# EAGLE design doodle with clock3 jump3 (EAGLE 6.2)
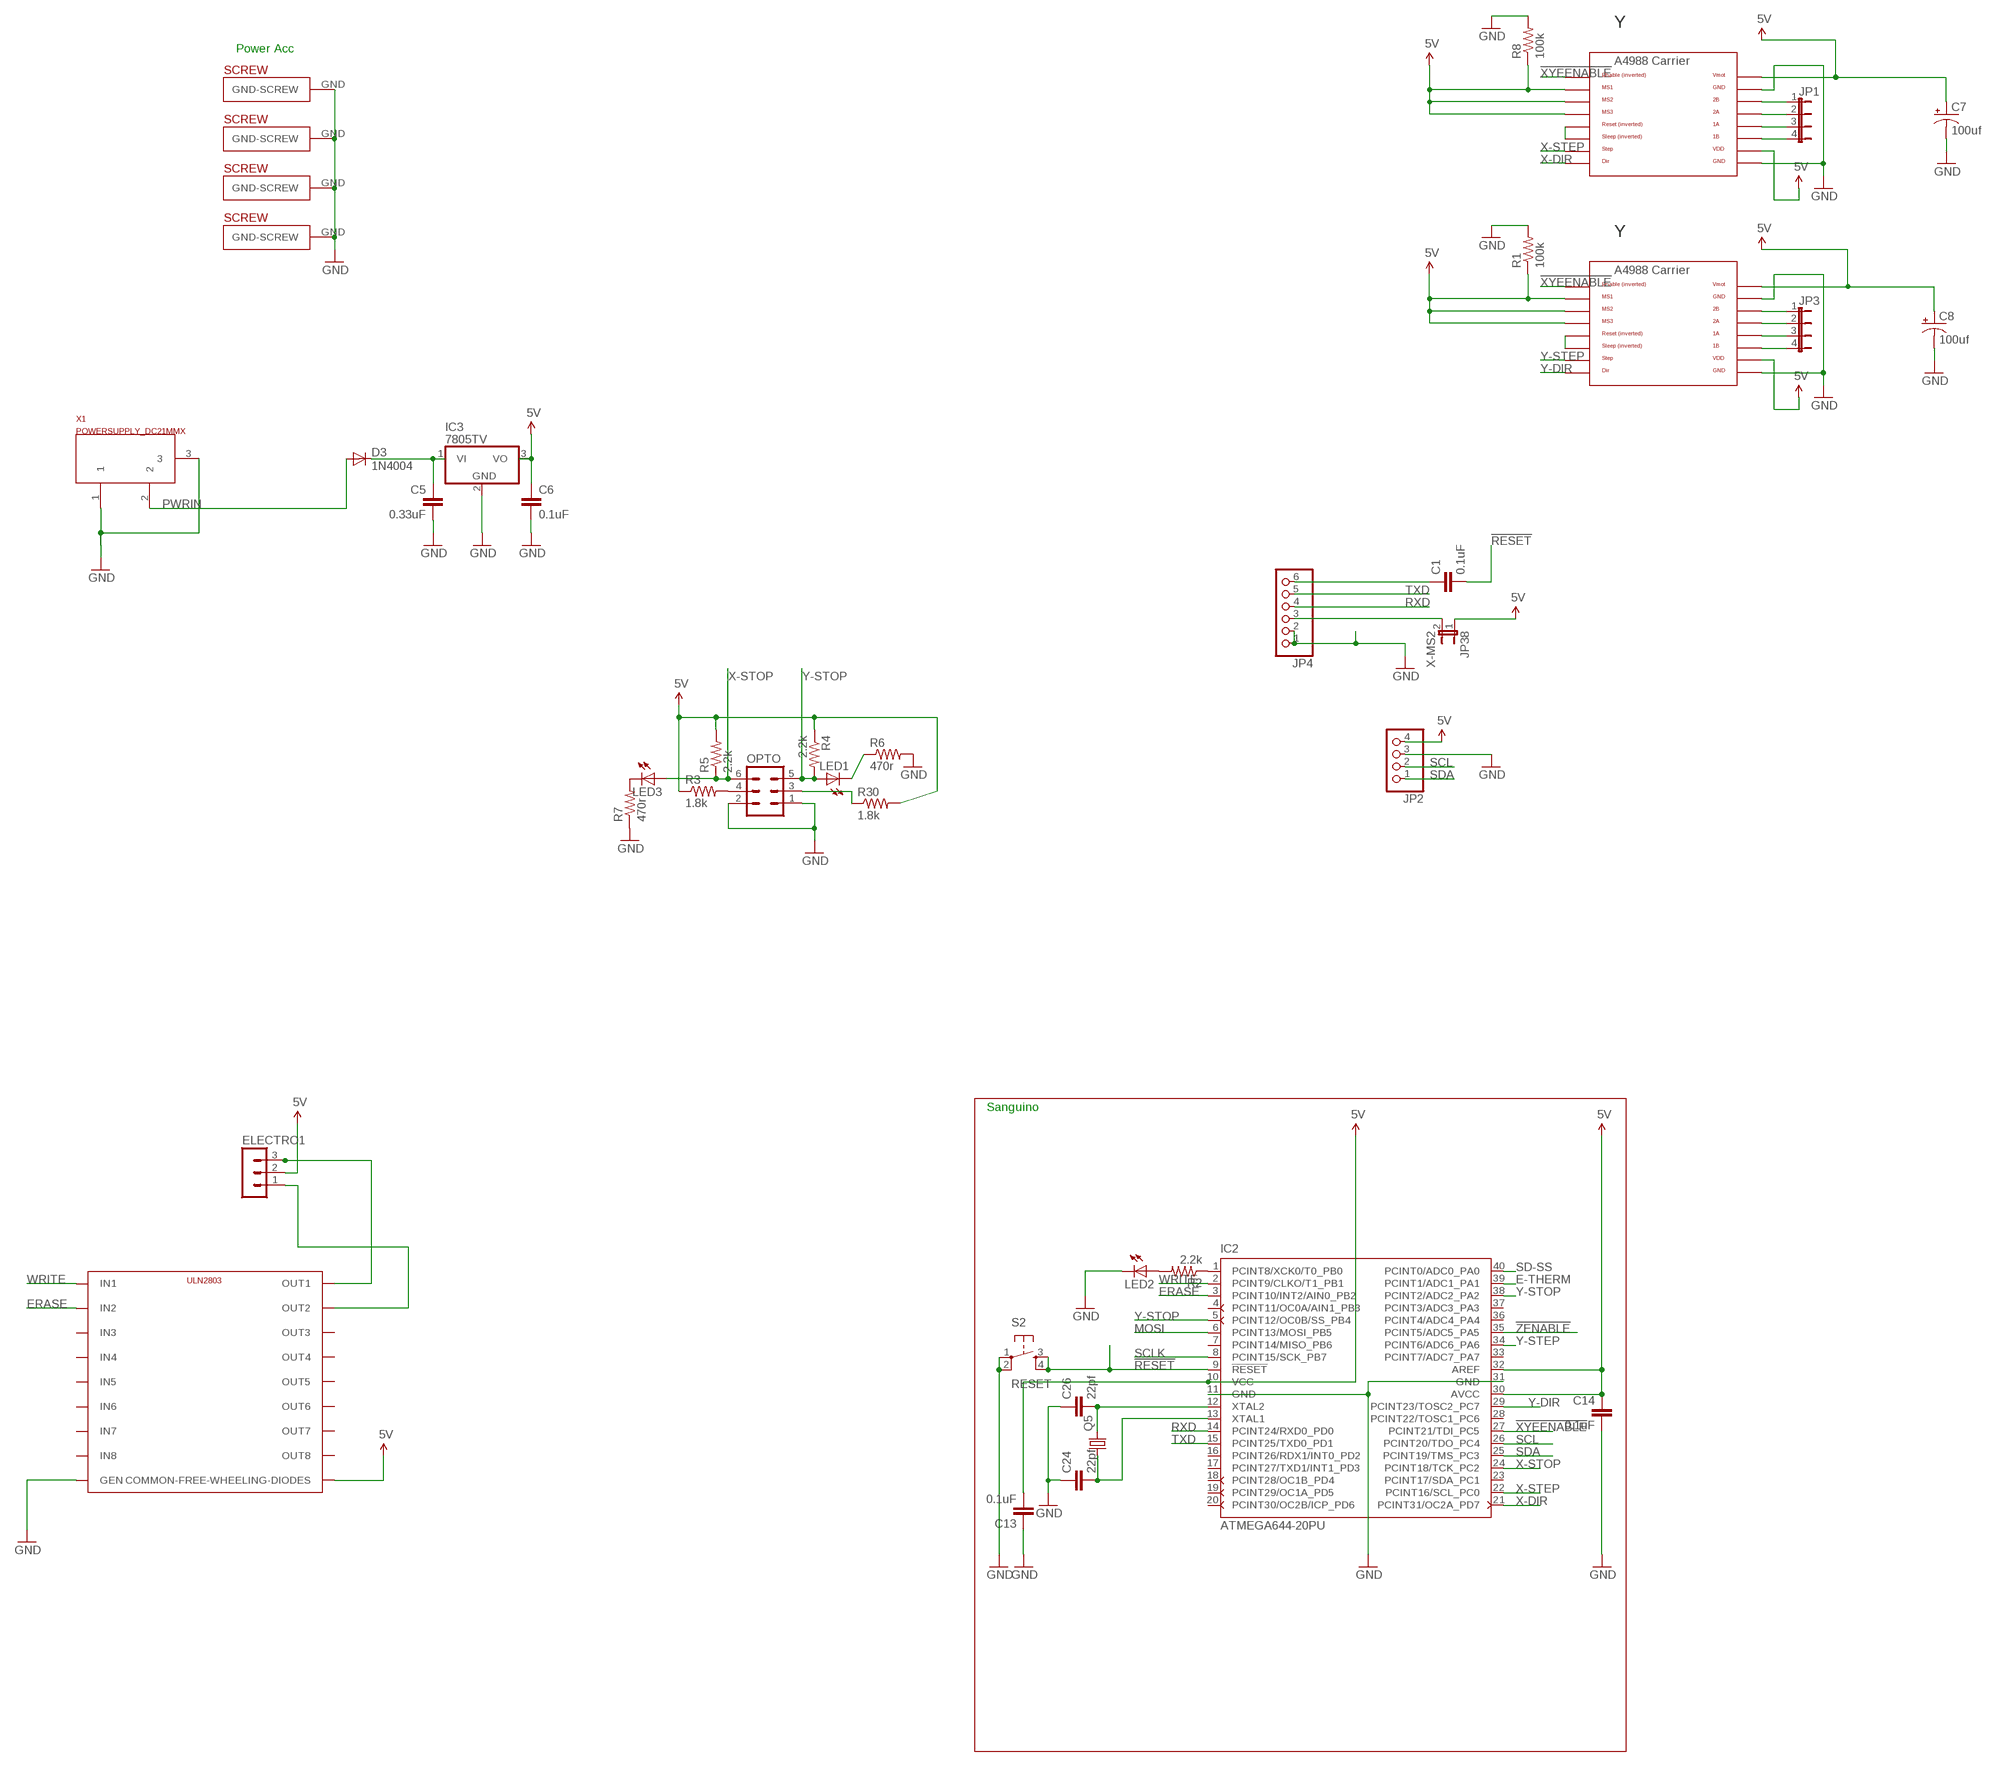
[diagram p0: schematic, sheet 1]

## Parts
C1  0.1uF  CAPPTH2  [CAP-PTH-SMALL2]
C5  0.33uF  CAPPTH2  [CAP-PTH-SMALL2]
C6  0.1uF  CAPPTH2  [CAP-PTH-SMALL2]
C7  100uf  CAP_POLPTH1  [CPOL-RADIAL-100UF-25V]
C8  100uf  CAP_POLPTH1  [CPOL-RADIAL-100UF-25V]
C13  0.1uF  CAPPTH2  [CAP-PTH-SMALL2]
C14  0.1uF  CAPPTH2  [CAP-PTH-SMALL2]
C24  22pf  CAPPTH2  [CAP-PTH-SMALL2]
C26  22pf  CAPPTH2  [CAP-PTH-SMALL2]
D3  1N4004  [DO41-10]
ELECTRO1  MA03-1  [MA03-1]
IC2  ATMEGA644-20PU  [DIL40]
IC3  7805TV  [TO220V]
JP1  JP4E  [JP4]
JP2  PINHD-1X4  [1X04]
JP3  JP4E  [JP4]
JP4  PINHD-1X6/90  [1X06/90]
JP38  X-MS2  JUMPER-2PTH  [1X02]
LED1  LED3MM  [LED3MM]
LED2  LED3MM  [LED3MM]
LED3  LED3MM  [LED3MM]
OPTO  MA03-2  [MA03-2]
Q5  CRYSTALHC49S  [HC49/S]
R1  100k  R-US_0207/7  [0207/7]
R2  2.2k  R-US_0207/2V  [0207/2V]
R3  1.8k  R-US_0207/2V  [0207/2V]
R4  2.2k  R-US_0207/2V  [0207/2V]
R5  2.2k  R-US_0207/2V  [0207/2V]
R6  470r  R-US_0207/2V  [0207/2V]
R7  470r  R-US_0207/2V  [0207/2V]
R8  100k  R-US_0207/7  [0207/7]
R30  1.8k  R-US_0207/2V  [0207/2V]
S2  RESET  TAC_SWITCHPTH  [TACTILE-PTH]
U$1  A4988BREAKOUT  [A4988BREAKOUT]
U$2  ULN2803  [P-DIP]
U$7  A4988BREAKOUT  [A4988BREAKOUT]
U$14  PLATED-SCREW  [PLATEDSCREW]
U$17  PLATED-SCREW  [PLATEDSCREW]
U$18  PLATED-SCREW  [PLATEDSCREW]
U$38  PLATED-SCREW  [PLATEDSCREW]
X1  POWERSUPPLY_DC21MMX  [POWERSUPPLY_DC-21MM]

## Nets
5V: C6.1 C7.1(+) C8.1(+) C13.2 C14.1 ELECTRO1.2 IC2.10(VCC) IC2.30(AVCC) IC2.32(AREF) IC3.3(VO) JP2.4 JP38.1 R1.1 R3.1 R4.1 R5.2 R8.1 R30.2 U$1.MS1 U$1.MS2 U$1.MS3 U$1.VDD U$1.VMOT U$2.COMMON-FREE-WHEELING-DIODES U$7.MS1 U$7.MS2 U$7.MS3 U$7.VDD U$7.VMOT
!RESET: C1.2 IC2.9(!RESET) S2.3 S2.4
!XYEENABLE: IC2.27(PCINT21/TDI_PC5) U$1.EN U$7.EN
!ZENABLE: IC2.35(PCINT5/ADC5_PA5)
E-THERM: IC2.39(PCINT1/ADC1_PA1)
ERASE: IC2.3(PCINT10/INT2/AIN0_PB2) U$2.IN2
GND: C5.2 C6.2 C7.2(-) C8.2(-) C13.1 C14.2 C24.1 C26.1 IC2.11(GND) IC2.31(GND) IC3.2(GND) JP2.3 JP4.1 JP4.2 LED2.K(C) OPTO.1 OPTO.2 R1.2 R6.2 R7.1 R8.2 S2.1 S2.2 U$1.GND U$1.GND@0(GND) U$2.GEN U$7.GND U$7.GND@0(GND) U$14.GND(GND-SCREW) U$17.GND(GND-SCREW) U$18.GND(GND-SCREW) U$38.GND(GND-SCREW) X1.1 X1.3
MOSI: IC2.6(PCINT13/MOSI_PB5)
N$1: U$1.RST U$1.SLP(SLEEP)
N$2: JP3.1 U$1.2B
N$3: JP3.2 U$1.2A
N$4: JP3.3 U$1.1A
N$5: JP3.4 U$1.1B
N$6: IC2.1(PCINT8/XCK0/T0_PB0) R2.1
N$7: LED2.A R2.2
N$9: OPTO.4 R3.2
N$11: LED1.K(C) R6.1
N$12: LED3.K(C) R7.2
N$13: OPTO.3 R30.1
N$14: JP1.1 U$7.2B
N$15: JP1.2 U$7.2A
N$16: JP1.3 U$7.1A
N$17: JP1.4 U$7.1B
N$18: ELECTRO1.1 U$2.OUT2
N$19: ELECTRO1.3 U$2.OUT1
N$23: U$7.RST U$7.SLP(SLEEP)
N$68: C5.1 D3.C IC3.1(VI)
N$70: C1.1 JP4.6
N$71: JP4.3 JP38.2
N$80: C26.2 IC2.12(XTAL2) Q5.2
N$81: C24.2 IC2.13(XTAL1) Q5.1
PWRIN [Power]: D3.A X1.2
RXD: IC2.14(PCINT24/RXD0_PD0) JP4.4
SCL: IC2.26(PCINT20/TDO_PC4) JP2.2
SCLK: IC2.8(PCINT15/SCK_PB7)
SD-SS: IC2.40(PCINT0/ADC0_PA0)
SDA: IC2.25(PCINT19/TMS_PC3) JP2.1
TXD: IC2.15(PCINT25/TXD0_PD1) JP4.5
WRITE: IC2.2(PCINT9/CLKO/T1_PB1) U$2.IN1
X-DIR: IC2.21(PCINT31/OC2A_PD7) U$7.DIR
X-STEP: IC2.22(PCINT16/SCL_PC0) U$7.STEP
X-STOP: IC2.24(PCINT18/TCK_PC2) LED3.A OPTO.6 R5.1
Y-DIR: IC2.29(PCINT23/TOSC2_PC7) U$1.DIR
Y-STEP: IC2.34(PCINT6/ADC6_PA6) U$1.STEP
Y-STOP: IC2.5(PCINT12/OC0B/SS_PB4) IC2.38(PCINT2/ADC2_PA2) LED1.A OPTO.5 R4.2
Unconnected: IC2.4(PCINT11/OC0A/AIN1_PB3) IC2.7(PCINT14/MISO_PB6) IC2.16(PCINT26/RDX1/INT0_PD2) IC2.17(PCINT27/TXD1/INT1_PD3) IC2.18(PCINT28/OC1B_PD4) IC2.19(PCINT29/OC1A_PD5) IC2.20(PCINT30/OC2B/ICP_PD6) IC2.23(PCINT17/SDA_PC1) IC2.28(PCINT22/TOSC1_PC6) IC2.33(PCINT7/ADC7_PA7) IC2.36(PCINT4/ADC4_PA4) IC2.37(PCINT3/ADC3_PA3) U$2.IN3 U$2.IN4 U$2.IN5 U$2.IN6 U$2.IN7 U$2.IN8 U$2.OUT3 U$2.OUT4 U$2.OUT5 U$2.OUT6 U$2.OUT7 U$2.OUT8

## Notes on the sheet
- Y
- Power Acc
- Y
- Sanguino

## Library data of the parts
C1 C5 C6 C13 C14 C24 C26 = SparkFun:CAP: Capacitor Standard 0603 ceramic capacitor, and 0.1" leaded capacitor.
C7 C8 = SparkFun:CAP_POL: Capacitor Polarized These are standard SMD and PTH capacitors. Normally 10uF, 47uF, and 100uF in electrolytic and tantalum varieties. Always verify the external diameter of the through hole cap, it varies with capacity, voltage, and manufacturer. The EIA devices should be standard.
D3 = diode:1N4004: DIODE general purpose rectifier, 1 A
ELECTRO1 = con-lstb:MA03-1: PIN HEADER; OC_FARNELL: unknown; OC_NEWARK: unknown
IC2 = atmel:ATMEGA644-*PU: 8-bit Microcontroller with 64K Bytes In-System Programmable Flash Auto generated by make-symbol-device-package-bsdl.ulp Rev. 34 Source: http://www.atmel.com/dyn/resources/prod_documents/doc2593.pdf; MPN: ATMEGA644-20PU; OC_FARNELL: 1288340; OC_NEWARK: 23M5060
IC3 = linear:78*: Positive VOLTAGE REGULATOR Source: http://cache.national.com/ds/LM/LM78L05.pdf http://www.fairchildsemi.com/ds/LM/LM7805.pdf
JP1 JP3 = jumper:JP4E: JUMPER
JP2 = pinhead:PINHD-1X4: PIN HEADER
JP4 = pinhead:PINHD-1X6: PIN HEADER
JP38 = SparkFun:JUMPER-2: Jumper Basic 0.1" spaced jumper. Use with breakaway headers.
LED1-LED3 = led:LED: LED OSRAM: - CHIPLED LG R971, LG N971, LY N971, LG Q971, LY Q971, LO R971, LY R971 LH N974, LH R974 LS Q976, LO Q976, LY Q976 LO Q996 - Hyper CHIPLED LW Q18S LB Q993, LB Q99A, LB R99A - SideLED LS A670, LO A670, LY A670, LG A670, LP A670 LB A673, LV A673, LT A673, LW A673 LH A674 LY A675 LS A676, LA A676, LO A676, LY A676, LW A676 LS A679, LY A679, LG A679 - Hyper Micro SIDELED® LS Y876, LA Y876, LO Y876, LY Y876 LT Y87S - SmartLED LW L88C, LW L88S LB L89C, LB L89S, LG L890 LS L89K, LO L89K, LY L89K LS L896, LA L896, LO L896, LY L896 - TOPLED LS T670, LO T670, LY T670, LG T670, LP T670 LSG T670, LSP T670, LSY T670, LOP T670, LYG T670 LG T671, LOG T671, LSG T671 LB T673, LV T673, LT T673, LW T673 LH T674 LS T676, LA T676, LO T676, LY T676, LB T676, LH T676, LSB T676, LW T676 LB T67C, LV T67C, LT T67C, LS T67K, LO T67K, LY T67K, LW E67C LS E67B, LA E67B, LO E67B, LY E67B, LB E67C, LV E67C, LT E67C LW T67C LS T679, LY T679, LG T679 LS T770, LO T770, LY T770, LG T770, LP T770 LB T773, LV T773, LT T773, LW T773 LH T774 LS E675, LA E675, LY E675, LS T675 LS T776, LA T776, LO T776, LY T776, LB T776 LHGB T686 LT T68C, LB T68C - Hyper Mini TOPLED® LB M676 - Mini TOPLED Santana® LG M470 LS M47K, LO M47K, LY M47K Source: http://www.osram.convergy.de LUXEON: - LUMILED® LXK2-PW12-R00, LXK2-PW12-S00, LXK2-PW14-U00, LXK2-PW14-V00 LXK2-PM12-R00, LXK2-PM12-S00, LXK2-PM14-U00 LXK2-PE12-Q00, LXK2-PE12-R00, LXK2-PE12-S00, LXK2-PE14-T00, LXK2-PE14-U00 LXK2-PB12-K00, LXK2-PB12-L00, LXK2-PB12-M00, LXK2-PB14-N00, LXK2-PB14-P00, LXK2-PB14-Q00 LXK2-PR12-L00, LXK2-PR12-M00, LXK2-PR14-Q00, LXK2-PR14-R00 LXK2-PD12-Q00, LXK2-PD12-R00, LXK2-PD12-S00 LXK2-PH12-R00, LXK2-PH12-S00 LXK2-PL12-P00, LXK2-PL12-Q00, LXK2-PL12-R00 Source: www.luxeon.com KINGBRIGHT: KA-3528ASYC Source: www.kingbright.com
OPTO = con-lstb:MA03-2: PIN HEADER; OC_FARNELL: unknown; OC_NEWARK: unknown
Q5 = crystal:CRYSTAL: CRYSTAL; OC_FARNELL: 1667008; OC_NEWARK: unknown
R1 R8 = adafruit:R-US_: RESISTOR, American symbol
R2-R7 R30 = resistor:R-US_: RESISTOR, American symbol
S2 = SparkFun:TAC_SWITCH: Momentary Switch Button commonly used for reset or general input. Spark Fun Electronics SKU : COM-00097
U$1 U$7 = RepRapjr:A4988BREAKOUT
U$2 = ULN2803:ULN2803
U$14 U$17 U$18 U$38 = Sanguinololu:PLATED-SCREW
X1 = SmartPrj:POWERSUPPLY_DC21MM

## Net classes
1 Power: width 0.3 mm, drill 0.406 mm, clearance 0.178 mm
2 gnd: width 0.305 mm, drill 0.559 mm, clearance 0.254 mm

## Board
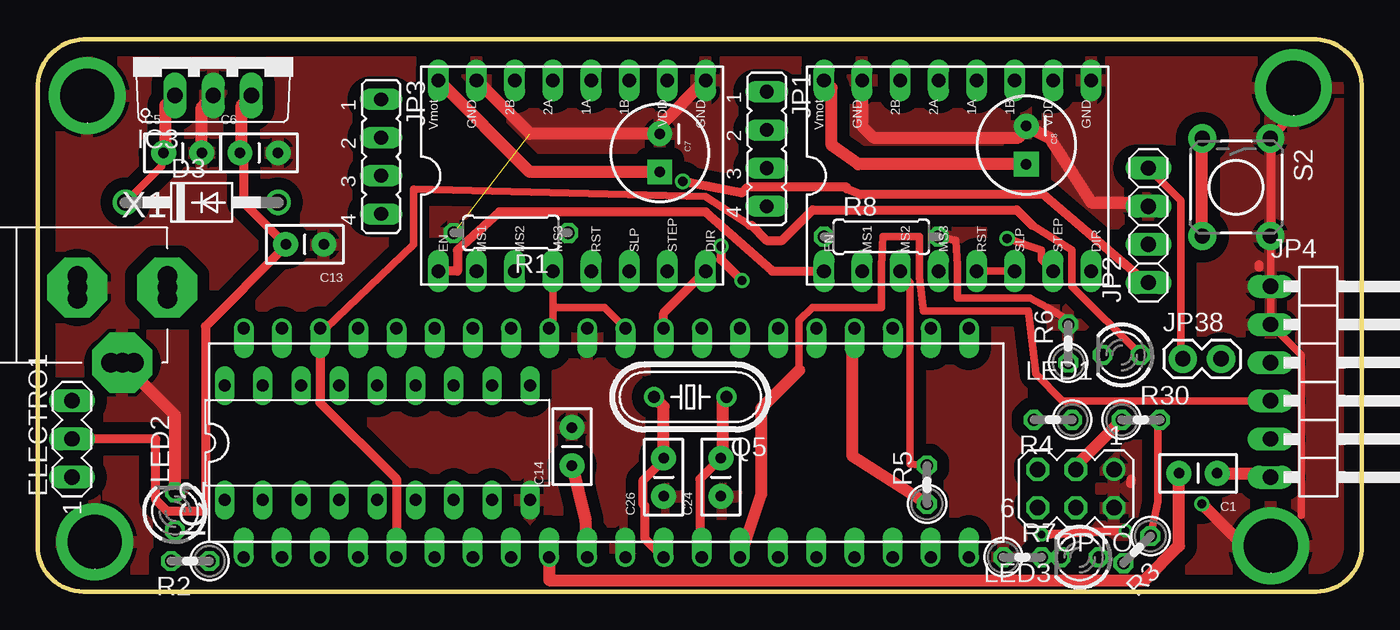
[diagram p1: board, top side]
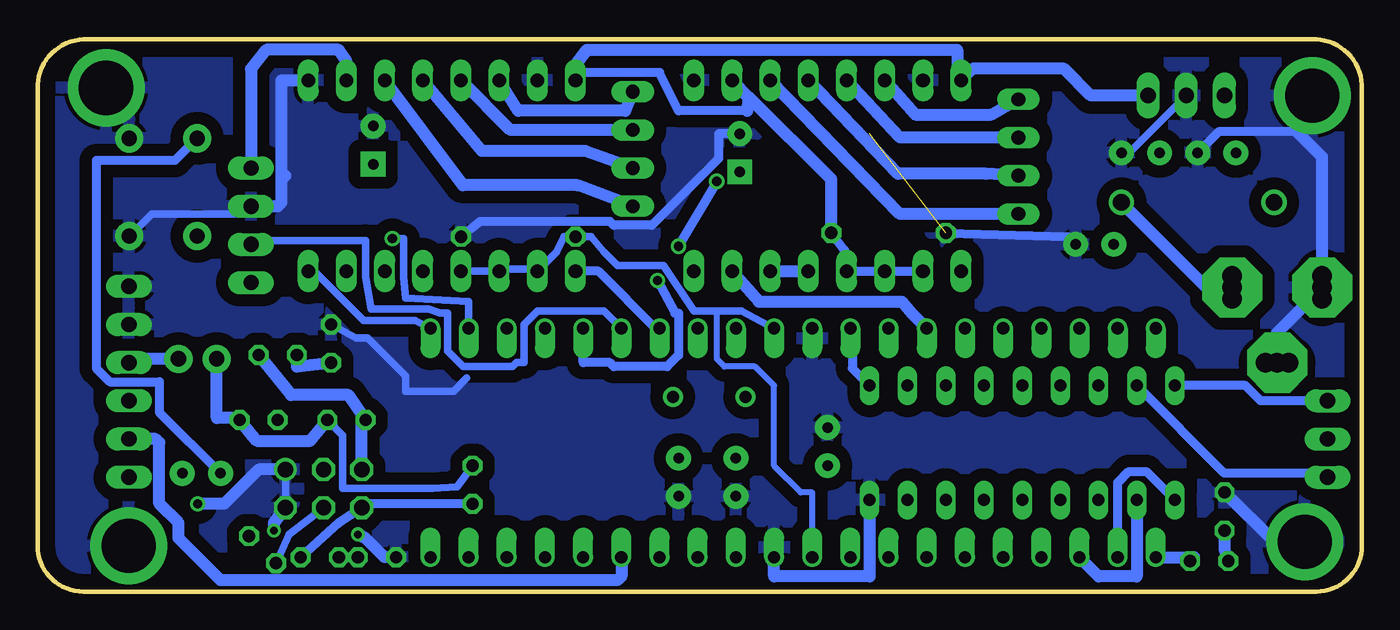
[diagram p2: board, bottom side, seen from below]

Size 88.12 x 36.75 mm. Coordinates in mm from the lower left corner, seen from the top.
Outline: 0,33.45 0,3.05 arc90 3.05,0 85.07,0 arc90 88.12,3.05 88.12,33.45 arc90 85.07,36.75 3.05,36.75 arc90 0,33.45
Copper layers (1*16): Top 0.035mm / dielectric 1.5mm / Bottom 0.035mm
Design rules: minimum track width 24mil, minimum drill 24mil, track to track 8mil, track to pad 8mil, pad to pad 8mil, via to via 8mil, smd to smd 8mil, copper to edge 40mil, drill to drill 8mil, minimum pad ring 10mil, minimum via ring 8mil, stop-mask expansion 4mil, vias tented up to drill 0mil, thermal gap 10mil

### Footprints (pad centres in the part's own frame; a part is rotated, then mirrored left to right if it is on the bottom)
CAP-PTH-SMALL2 = drill 0.7 pad 1.651: 1 0,0; 2 2.54,0
CPOL-RADIAL-100UF-25V = drill 0.7 pad 1.651 square: 1 1.27,0 | drill 0.7 pad 1.651: 2 -1.27,0
DO41-10 = drill 1.118: A 5.08,0; C -5.08,0
MA03-1 = drill 1.016 long: 1 -2.54,0; 2 0,0; 3 2.54,0
DIL40 = drill 0.813 offset: 1 -24.13,-7.62; 2 -21.59,-7.62; 3 -19.05,-7.62; 4 -16.51,-7.62; 5 -13.97,-7.62; 6 -11.43,-7.62; 7 -8.89,-7.62; 8 -6.35,-7.62; 9 -3.81,-7.62; 10 -1.27,-7.62; 11 1.27,-7.62; 12 3.81,-7.62; 13 6.35,-7.62; 14 8.89,-7.62; 15 11.43,-7.62; 16 13.97,-7.62; 17 16.51,-7.62; 18 19.05,-7.62; 19 21.59,-7.62; 20 24.13,-7.62; 21 24.13,7.62; 22 21.59,7.62; 23 19.05,7.62; 24 16.51,7.62; 25 13.97,7.62; 26 11.43,7.62; 27 8.89,7.62; 28 6.35,7.62; 29 3.81,7.62; 30 1.27,7.62; 31 -1.27,7.62; 32 -3.81,7.62; 33 -6.35,7.62; 34 -8.89,7.62; 35 -11.43,7.62; 36 -13.97,7.62; 37 -16.51,7.62; 38 -19.05,7.62; 39 -21.59,7.62; 40 -24.13,7.62
TO220V = drill 1.016 long: 1 -2.54,-2.54; 2 0,-2.54; 3 2.54,-2.54
JP4 = drill 0.914 long: 1 -3.81,0; 2 -1.27,0; 3 1.27,0; 4 3.81,0
1X04 = drill 1.016 long: 1 -3.81,0; 2 -1.27,0; 3 1.27,0; 4 3.81,0
1X06/90 = drill 1.016 long: 1 -6.35,-3.81; 2 -3.81,-3.81; 3 -1.27,-3.81; 4 1.27,-3.81; 5 3.81,-3.81; 6 6.35,-3.81
1X02 = drill 1.016 pad 1.88: 1 0,0; 2 2.54,0
LED3MM = drill 0.813 octagon: A -1.27,0; K 1.27,0
MA03-2 = drill 1.016: 1 -2.54,-1.27 | drill 1.016 octagon: 2 -2.54,1.27; 3 0,-1.27; 4 0,1.27; 5 2.54,-1.27; 6 2.54,1.27
HC49/S = drill 0.813: 1 -2.413,0; 2 2.413,0
0207/7 = drill 0.813 octagon: 1 -3.81,0; 2 3.81,0
0207/2V = drill 0.813 octagon: 1 -1.27,0; 2 1.27,0
TACTILE-PTH = drill 1.016 pad 1.88: 1 -3.251,2.261; 2 3.251,2.261; 3 -3.251,-2.261; 4 3.251,-2.261
A4988BREAKOUT = drill 0.9 long: 1A 8.89,1.27; 1B 11.43,1.27; 2A 6.35,1.27; 2B 3.81,1.27; DIR 16.51,-11.43; EN -1.27,-11.43; GND 16.51,1.27; GND@0 1.27,1.27; MS1 1.27,-11.43; MS2 3.81,-11.43; MS3 6.35,-11.43; RST 8.89,-11.43; SLP 11.43,-11.43; STEP 13.97,-11.43; VDD 13.97,1.27; VMOT -1.27,1.27
P-DIP = drill 0.8 long: COMMON-FREE-WHEELING-DIODES 3.81,-10.16; GEN -3.81,-10.16; IN1 -3.81,10.16; IN2 -3.81,7.62; IN3 -3.81,5.08; IN4 -3.81,2.54; IN5 -3.81,0; IN6 -3.81,-2.54; IN7 -3.81,-5.08; IN8 -3.81,-7.62; OUT1 3.81,10.16; OUT2 3.81,7.62; OUT3 3.81,5.08; OUT4 3.81,2.54; OUT5 3.81,0; OUT6 3.81,-2.54; OUT7 3.81,-5.08; OUT8 3.81,-7.62
PLATEDSCREW = drill 3.6: GND 0,0
POWERSUPPLY_DC-21MM = drill 1.3 pad 4 octagon: 1 -5.08,-3.353; 2 -0.076,-6.35; 3 -0.076,-0.356 | drill 1.3: 4 -5.08,-4.115; 5 -5.08,-2.591; 6 -0.838,-0.356; 7 0.686,-0.356; 8 -0.838,-6.35; 9 0.686,-6.35

### Placement (x,y rotation side)
C1  78.49,7.87 180 top
C5  8.38,29.21 0 top
C6  13.46,29.21 0 top
C7  41.4,29.21 270 top
C8  65.79,29.72 270 top
C13  19.05,23.11 180 top
C14  35.56,8.38 90 top
C24  45.47,6.35 90 top
C26  41.66,6.35 90 top
D3  10.92,25.91 0 top
ELECTRO1  2.29,10.16 90 top
IC2  37.85,9.91 0 top
IC3  11.68,35.56 0 top
JP1  48.51,29.46 270 top
JP2  73.91,24.38 90 top
JP3  22.86,28.96 270 top
JP4  85.85,13.97 270 top
JP38  76.2,15.49 0 top
LED1  72.14,15.75 180 top
LED2  9.14,5.33 90 top
LED3  69.34,2.29 180 top
OPTO  69.09,6.86 180 top
Q5  43.43,12.95 180 top
R1  31.5,23.88 180 top
R2  10.16,2.03 180 top
R3  73.15,2.79 225 top
R4  67.56,11.43 180 top
R5  59.18,7.11 90 top
R6  68.58,16.51 90 top
R7  65.53,2.29 0 top
R8  56.13,23.62 0 top
R30  73.41,11.43 0 top
S2  79.76,26.92 270 top
U$1  27.94,32.77 0 top
U$2  22.61,9.91 90 top
U$7  53.59,32.77 0 top
U$14  3.3,33.02 0 top
U$17  3.81,3.3 0 top
U$18  82.04,3.05 0 top
U$38  83.57,33.53 0 top
X1  2.29,20.32 90 top

### Tracks (layer width: path | path; a pad name or v marks a point on that pad's centre or on a via)
5V
  Top 0.508: R3.1 74.55,5.97 74.55,11.3 R30.2 | JP2.4 76.07,26.04 76.07,15.62 JP38.1 | R5.2 58.04,8.51 58.04,20.57 57.4,21.21 U$7.MS2 | IC2.32 34.29,17.78 34.29,18.92 | U$1.MS3 34.29,18.92 | IC2.30 37.72,18.92 34.29,18.92 | 13.59,29.34 C6.1
  Top 0.61: C6.1 13.72,28.96 13.72,25.91 C13.2 16.38,22.86 11.18,17.65 11.18,5.33 8.64,5.33 7.87,6.1 7.87,10.16 ELECTRO1.2
  Top 0.813: IC2.10 36.45,3.68 36.45,4.7 C14.1 | IC3.3 13.59,32.38 13.59,29.34 | C8.1 54.61,28.45 52.83,29.72 52.83,33.53 U$7.VMOT | C7.1 32.77,27.94 U$1.VMOT
  Bottom 0.406: IC2.10 36.58,6.6 37.34,6.6 39.12,8.38 39.12,13.72 40.39,14.99 42.42,14.99 42.93,15.49 42.93,18.67
  Bottom 0.508: 74.8,11.56 R30.2 | U$7.MS3 U$7.MS2 57.28,21.46 54.99,21.46 U$7.MS1 53.59,22.61 53.09,23.62 R8.1 51.31,23.62 50.42,22.61 49.53,21.72 46.48,21.72 44.45,18.67 42.93,18.67 41.28,18.67 IC2.30 | 34.42,21.46 U$1.MS3 | R4.1 67.82,10.41 67.82,6.86 61.85,6.86 60.2,6.99 R5.2
  Bottom 0.61: U$1.MS1 U$1.MS2 U$1.MS3 | R1.1 34.42,22.73 34.42,21.46 | 51.94,34.54 46.74,34.54 45.47,32 40.89,32 | U$2.COMMON-FREE-WHEELING-DIODES 33.91,14.86 33.91,17.4 IC2.32
  Bottom 0.813: R4.1 69.98,10.03 73.53,10.03 R30.2 | JP38.1 76.2,11.56 74.8,11.56 | 40.77,32.89 35.31,27.43 R1.1 | 40.77,32.89 U$1.VDD | 40.89,32 40.77,32.89 | 51.94,34.54 52.32,34.16 U$7.VMOT 52.32,35.05 51.56,36.07 26.92,36.07 26.92,34.29 U$1.VMOT 25.91,34.8 19.81,34.8 18.03,33.02 IC3.3 | U$7.VDD 67.56,35.31 68.07,36.07 72.9,36.07 73.91,34.8 JP2.4
!RESET
  Top 0.508: 77.47,30.1 S2.3 | 77.47,23.75 S2.4
  Top 0.813: 77.47,23.75 77.47,30.1 | IC2.9 34.04,0.76 73.66,0.76 75.95,3.05 C1.2
  Bottom 0.508: 77.6,30.1 S2.3
  Bottom 0.61: C1.2 80.01,11.94 80.01,13.97 83.31,13.97 84.2,14.86 84.2,28.7 78.99,28.7 77.6,30.1
!XYEENABLE
  Top 0.61: U$1.EN 27.94,21.34 27.94,22.73 30.73,25.27 44.45,25.27 48.89,21.34 U$7.EN
  Bottom 0.61: IC2.27 46.99,17.53 50.8,21.34 U$7.EN
ERASE
  Bottom 0.813: U$2.IN2 14.99,1.02 17.53,1.02 IC2.3
GND  (via drill 0.5 pad 0.61)  (2 unrouted)
  Top 0.508: 82.04,30.23 S2.1 82.04,29.97 | 82.04,23.88 S2.2 82.04,23.62 JP4.1 JP4.2 84.07,15.75 84.07,5.08 | R6.2 68.45,18.16 67.18,18.92 66.04,19.56 61.21,19.56 61.21,21.72 61.09,23.37 R8.2
  Top 0.61: 82.04,30.23 83.57,31.75 U$38.GND | 82.04,29.97 82.04,23.88 | v66.8,3.81 v72.39,4.06 | 81.28,21.59 81.28,21.74 | 72.77,7.49 72.71,7.2
  Top 0.813: IC3.2 10.92,32.26 C5.2 | LED2.K 9.14,11.73 X1.1 | U$7.GND@0 54.86,30.99 55.63,30.23 65.28,30.23 C8.2 67.31,30.23 70.1,25.91 73.66,25.91 JP2.3 | U$1.GND@0 32.77,30.48 C7.2 41.4,30.99 U$1.GND | U$18.GND 80.26,3.05 77.47,5.84
  Bottom 0.508: JP2.3 74.42,25.15 80.52,25.15 81.91,23.75 S2.2 | OPTO.1 OPTO.2 71.75,5.46 | R6.2 66.93,16.89 66.17,16.89 63.63,14.35 63.63,13.34 60.45,13.34 59.56,14.22 | IC3.2 15.37,29.34 15.88,29.34 C6.2
  Bottom 0.61: C5.2 9.53,30.61 4.32,30.61 U$14.GND | C13.1 19.56,23.62 R1.2 | R8.2 58.67,24.64 50.04,24.64 49.78,24.38 47.24,24.38 42.8,28.83 42.8,30.48 C7.2
  Bottom 0.813: U$17.GND 5.84,3.3 LED2.K | X1.1 5.64,17.25 X1.3 2.64,28.93 4.32,30.61 | JP2.3 72.14,25.65 71.88,25.91 71.88,27.43 | 71.88,27.43 71.88,34.04 U$7.GND | 71.63,27.69 71.88,27.43 | R7.1 65.02,2.29 66.29,3.56 v66.8,3.81 | v72.39,4.06 72.39,4.57 OPTO.2 | U$2.GEN 32.77,1.02 39.12,1.02 IC2.11 | OPTO.1 73.41,8.13 75.69,5.84 77.47,5.84
  pour Top (isolate 0.813): 3.81,37.34 85.6,37.34 arc-90 88.14,33.53 88.14,2.79 arc-90 85.34,0 2.79,0 arc-90 0,2.79 0,33.53 arc-90 3.05,36.58
  pour Bottom (isolate 0.813): 3.05,36.32 85.09,36.32 arc-90 88.14,33.27 88.14,3.05 arc-90 85.09,0 3.05,0 arc-90 0,3.05 0,33.53 arc-90 2.79,36.32
N$1
  Bottom 0.813: U$1.SLP U$1.RST
N$2
  Bottom 0.813: U$1.2B 29.72,31.75 24.64,31.75 23.37,32.51 23.11,32.51 JP3.1
N$3
  Bottom 0.813: U$1.2A 30.73,30.23 JP3.2
N$4
  Bottom 0.813: U$1.1A 30.86,27.81 25.02,27.81 JP3.3
N$5
  Bottom 0.813: U$1.1B 30.73,25.15 JP3.4
N$6
  Bottom 0.813: R2.1 11.18,2.29 IC2.1
N$7
  Bottom 0.813: R2.2 9.14,2.79 LED2.A
N$8  (via drill 0.6)
  other vias: 77.47,5.84
N$9
  Bottom 0.508: R3.2 71.37,3.81 OPTO.4
N$11
  Bottom 0.813: R6.1 70.87,14.99 LED1.K
N$12
  Bottom 0.61: LED3.K R7.2
N$13
  Top 0.813: R30.1 69.09,8.38 OPTO.3
N$14
  Bottom 0.813: U$7.2B 56.13,32 49.02,32 JP1.1
N$15
  Bottom 0.813: U$7.2A 56.64,30.73 JP1.2
N$16
  Bottom 0.813: U$7.1A 58.55,29.34 51.69,29.34 JP1.3
N$17
  Bottom 0.813: U$7.1B 59.82,27.05 52.2,27.05 JP1.4
N$18
  Bottom 0.61: U$2.OUT2 9.14,7.87 2.29,7.87 ELECTRO1.1
N$19
  Bottom 0.61: U$2.OUT1 7.75,13.72 6.73,12.7 ELECTRO1.3
N$23
  Top 0.508: U$7.SLP U$7.RST
N$68
  Top 0.508: D3.C 8.25,28.32 8.25,29.08 C5.1 8.51,29.34
  Top 0.813: IC3.1 8.51,32.38 8.51,29.34
N$70
  Top 0.813: JP4.6 81.79,7.87 C1.1
N$71
  Bottom 0.813: JP4.3 81.79,15.49 JP38.2
N$80
  Top 0.61: IC2.12 40.39,3.56 40.39,5.71 40.26,5.84 40.26,7.37 41.53,8.64 C26.2
  Top 0.813: Q5.2 41.66,12.32 C26.2
N$81
  Top 0.61: IC2.13 44.07,2.41 44.07,7.49 C24.2 45.59,9.14 | 45.59,12.7 Q5.1
  Top 0.813: 45.59,9.14 45.59,12.7
PWRIN
  Bottom 0.813: X1.2 10.34,20.24 D3.A
RXD
  Top 0.508: 50.67,14.73 50.67,18.03 51.56,18.92 56.13,18.92 56.13,21.72 56.26,23.62 58.67,23.62 58.67,20.95 58.93,18.67 65.91,18.67 66.42,14.48 68.2,12.7 JP4.4
  Top 0.813: IC2.14 48.13,6.48 48.13,12.19 50.67,14.73
SCL
  Bottom 0.508: IC2.26 50.42,18.67 54.86,18.67 55.75,17.78 55.75,15.24 56.26,15.24 56.52,14.99 59.82,14.99 60.83,16 60.83,18.54 61.34,18.54 62.1,18.8 65.91,18.8 66.29,20.95 66.29,23.37 73.66,23.37 JP2.2
SDA  (via drill 0.61)
  Top 0.61: v46.86,20.7 45.47,22.1 v45.47,22.99 | v42.93,27.3 46.86,26.54 47.24,26.92 53.85,26.92 53.85,26.8 54.74,26.42 66.93,26.42 73.79,20.57 JP2.1
  Bottom 0.61: IC2.25 51.82,15.24 50.04,15.24 49.78,14.99 46.23,14.99 45.47,15.75 45.47,18.54 45.72,18.54 v46.86,20.7 | v42.93,27.3 v45.47,22.99
TXD
  Bottom 0.813: IC2.15 49.28,1.02 49.53,0.76 75.95,0.76 78.74,3.56 78.74,4.57 80.01,5.84 80.01,9.91 80.26,10.16 JP4.5
WRITE
  Bottom 0.61: U$2.IN1 14.35,8 15.49,8 16.26,7.24 IC2.2
X-DIR
  Bottom 0.508: IC2.21 62.99,18.03 66.42,18.03 69.72,21.34 U$7.DIR
X-STEP  (via drill 0.61)
  Top 0.508: v64.52,23.5 66.8,22.73 66.8,22.1 U$7.STEP
  Bottom 0.508: IC2.22 59.44,19.3 63.63,19.56 63.75,20.95 63.75,23.5 v64.52,23.5
X-STOP
  Top 0.813: IC2.24 54.23,16.13 54.23,9.02 R5.1
  Bottom 0.61: LED3.A 68.07,4.57 OPTO.6 66.29,5.71 66.17,5.84 R5.1
Y-DIR
  Top 0.61: IC2.29 41.66,18.54 U$1.DIR
Y-STEP
  Bottom 0.813: IC2.34 29.97,18.54 30.61,19.3 40.13,19.3 U$1.STEP
Y-STOP
  Top 0.508: LED1.A 68.83,20.32 68.83,22.73 66.17,24.38 | 47.37,24.38 44.45,26.29 25.02,26.8 25.02,23.11 19.18,17.53 IC2.38
  Top 0.61: IC2.5 23.88,7.49 18.8,12.57 IC2.38 | 47.37,24.38 47.5,24.38 48.51,23.37 49.53,23.37 51.56,25.4 65.15,25.4 66.17,24.38
  Bottom 0.508: 66.55,11.18 R4.2
  Bottom 0.813: OPTO.5 66.55,11.18 | LED1.A 71.25,13.08 67.44,13.08 R4.2